# Altium schematic sheet Embedded_Chip.SchDoc
size A; SheetNumber: 4; SheetTotal: 9
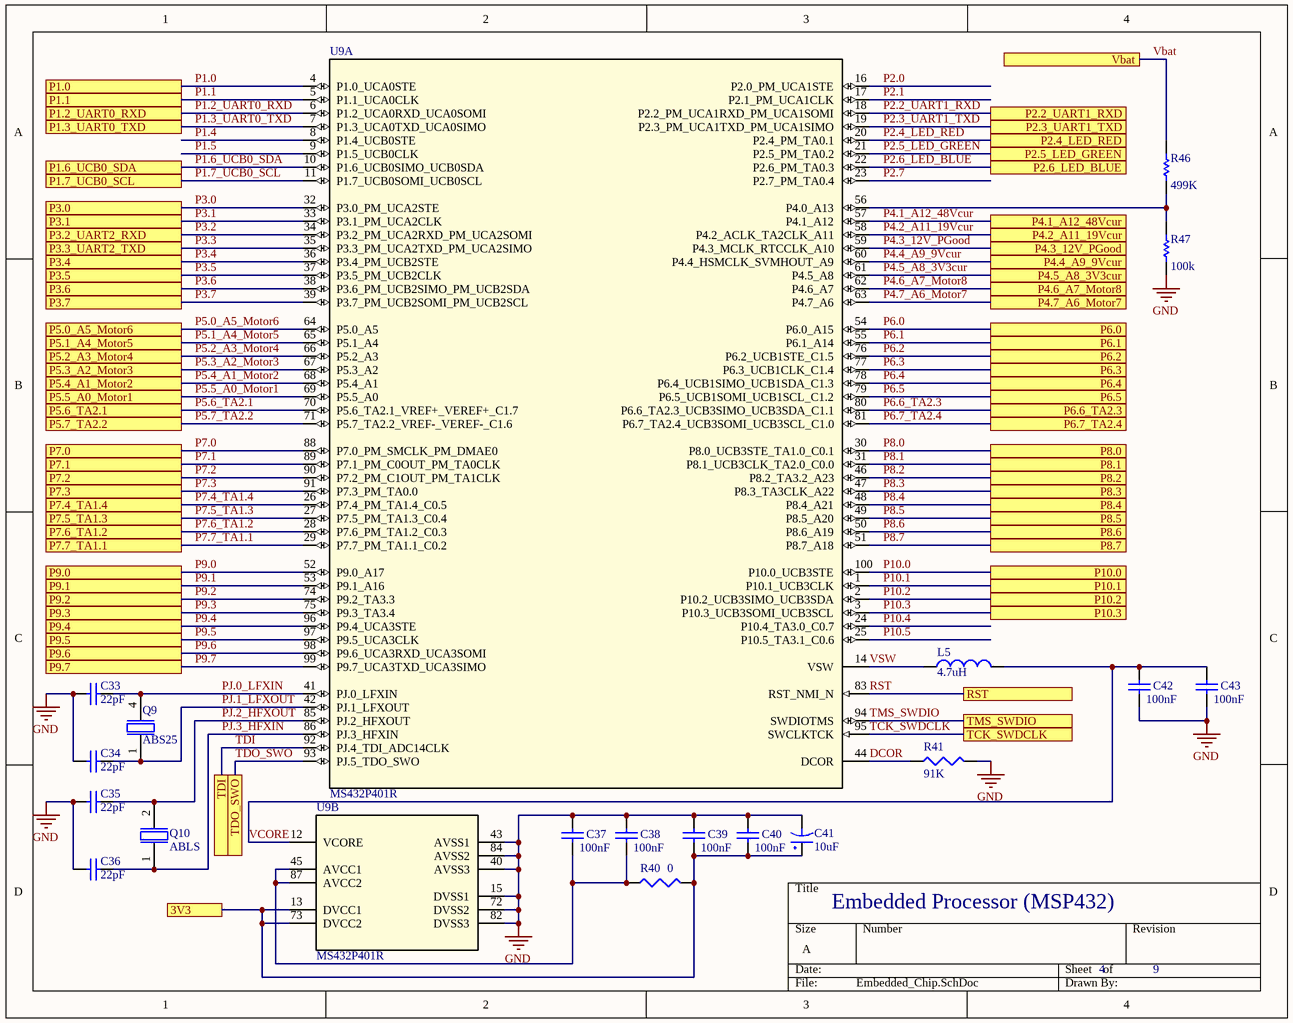
[diagram p0: Embedded_Chip.SchDoc]

## Parts
C33  value 22pF  [C1206]  (hidden comment: Cap Semi)
C34  value 22pF  [C1206]  (hidden comment: Cap Semi)
C35  value 22pF  [C1206]  (hidden comment: Cap Semi)
C36  value 22pF  [C1206]  (hidden comment: Cap Semi)
C37  value 100nF  [C1206]  (hidden comment: Cap Semi)
C38  value 100nF  [C1206]  (hidden comment: Cap Semi)
C39  value 100nF  [C1206]  (hidden comment: Cap Semi)
C40  value 100nF  [C1206]  (hidden comment: Cap Semi)
C41  10uF  [UWX1C100MCL2GB]
C42  value 100nF  [C1206]  (hidden comment: Cap Semi)
C43  value 100nF  [C1206]  (hidden comment: Cap Semi)
L5  value 4.7uH  [0806 (Metric 2016)]  (hidden comment: Inductor)
Q9  ABS25  [ABS25]
Q10  ABLS  [ABLS]
R40  value 0  [J1-0603]  (hidden comment: Res3)
R41  value 91K  [J1-0603]  (hidden comment: Res3)
R46  value 499K  [J1-0603]  (hidden comment: Res1)
R47  value 100k  [J1-0603]  (hidden comment: Res1)
U9  MS432P401R  [PZ0100A_M]  (parts A,B of 2)

## Ports
3V3, P1.0, P1.1, P1.2_UART0_RXD, P1.3_UART0_TXD, P1.6_UCB0_SDA, P1.7_UCB0_SCL, P2.2_UART1_RXD, P2.3_UART1_TXD, P2.4_LED_RED, P2.5_LED_GREEN, P2.6_LED_BLUE, P3.0, P3.1, P3.2_UART2_RXD, P3.3_UART2_TXD, P3.4, P3.5, P3.6, P3.7, P4.1_A12_48Vcur, P4.2_A11_19Vcur, P4.3_12V_PGood, P4.4_A9_9Vcur, P4.5_A8_3V3cur, P4.6_A7_Motor8, P4.7_A6_Motor7, P5.0_A5_Motor6, P5.1_A4_Motor5, P5.2_A3_Motor4, P5.3_A2_Motor3, P5.4_A1_Motor2, P5.5_A0_Motor1, P5.6_TA2.1, P5.7_TA2.2, P6.0, P6.1, P6.2, P6.3, P6.4, P6.5, P6.6_TA2.3, P6.7_TA2.4, P7.0, P7.1, P7.2, P7.3, P7.4_TA1.4, P7.5_TA1.3, P7.6_TA1.2, P7.7_TA1.1, P8.0, P8.1, P8.2, P8.3, P8.4, P8.5, P8.6, P8.7, P9.0, P9.1, P9.2, P9.3, P9.4, P9.5, P9.6, P9.7, P10.0, P10.1, P10.2, P10.3, RST, TCK_SWDCLK, TDI, TDO_SWO, TMS_SWDIO, Vbat

## Nets
GND: C33.1 C34.1 C35.1 C36.1 C37.2 C38.2 C39.2 C40.2 C41.2 C42.1 C43.1 R41.2 R47.1 U9.15(DVSS1) U9.40(AVSS3) U9.43(AVSS1) U9.72(DVSS2) U9.82(DVSS3) U9.84(AVSS2)
3V3: C39.1 C40.1 C41.1 R40.2 U9.13(DVCC1) U9.73(DVCC2) ; port 3V3
DCOR: R41.1 U9.44(DCOR)
P1.0: U9.4(P1.0_UCA0STE) ; port P1.0
P1.1: U9.5(P1.1_UCA0CLK) ; port P1.1
P1.2_UART0_RXD: U9.6(P1.2_UCA0RXD_UCA0SOMI) ; port P1.2_UART0_RXD
P1.3_UART0_TXD: U9.7(P1.3_UCA0TXD_UCA0SIMO) ; port P1.3_UART0_TXD
P1.4: U9.8(P1.4_UCB0STE)
P1.5: U9.9(P1.5_UCB0CLK)
P1.6_UCB0_SDA: U9.10(P1.6_UCB0SIMO_UCB0SDA) ; port P1.6_UCB0_SDA
P1.7_UCB0_SCL: U9.11(P1.7_UCB0SOMI_UCB0SCL) ; port P1.7_UCB0_SCL
P2.0: U9.16(P2.0_PM_UCA1STE)
P2.1: U9.17(P2.1_PM_UCA1CLK)
P2.2_UART1_RXD: U9.18(P2.2_PM_UCA1RXD_PM_UCA1SOMI) ; port P2.2_UART1_RXD
P2.3_UART1_TXD: U9.19(P2.3_PM_UCA1TXD_PM_UCA1SIMO) ; port P2.3_UART1_TXD
P2.4_LED_RED: U9.20(P2.4_PM_TA0.1) ; port P2.4_LED_RED
P2.5_LED_GREEN: U9.21(P2.5_PM_TA0.2) ; port P2.5_LED_GREEN
P2.6_LED_BLUE: U9.22(P2.6_PM_TA0.3) ; port P2.6_LED_BLUE
P2.7: U9.23(P2.7_PM_TA0.4)
P3.0: U9.32(P3.0_PM_UCA2STE) ; port P3.0
P3.1: U9.33(P3.1_PM_UCA2CLK) ; port P3.1
P3.2: U9.34(P3.2_PM_UCA2RXD_PM_UCA2SOMI) ; port P3.2_UART2_RXD
P3.3: U9.35(P3.3_PM_UCA2TXD_PM_UCA2SIMO) ; port P3.3_UART2_TXD
P3.4: U9.36(P3.4_PM_UCB2STE) ; port P3.4
P3.5: U9.37(P3.5_PM_UCB2CLK) ; port P3.5
P3.6: U9.38(P3.6_PM_UCB2SIMO_PM_UCB2SDA) ; port P3.6
P3.7: U9.39(P3.7_PM_UCB2SOMI_PM_UCB2SCL) ; port P3.7
P4.1_A12_48Vcur: U9.57(P4.1_A12) ; port P4.1_A12_48Vcur
P4.2_A11_19Vcur: U9.58(P4.2_ACLK_TA2CLK_A11) ; port P4.2_A11_19Vcur
P4.3_12V_PGood: U9.59(P4.3_MCLK_RTCCLK_A10) ; port P4.3_12V_PGood
P4.4_A9_9Vcur: U9.60(P4.4_HSMCLK_SVMHOUT_A9) ; port P4.4_A9_9Vcur
P4.5_A8_3V3cur: U9.61(P4.5_A8) ; port P4.5_A8_3V3cur
P4.6_A7_Motor8: U9.62(P4.6_A7) ; port P4.6_A7_Motor8
P4.7_A6_Motor7: U9.63(P4.7_A6) ; port P4.7_A6_Motor7
P5.0_A5_Motor6: U9.64(P5.0_A5) ; port P5.0_A5_Motor6
P5.1_A4_Motor5: U9.65(P5.1_A4) ; port P5.1_A4_Motor5
P5.2_A3_Motor4: U9.66(P5.2_A3) ; port P5.2_A3_Motor4
P5.3_A2_Motor3: U9.67(P5.3_A2) ; port P5.3_A2_Motor3
P5.4_A1_Motor2: U9.68(P5.4_A1) ; port P5.4_A1_Motor2
P5.5_A0_Motor1: U9.69(P5.5_A0) ; port P5.5_A0_Motor1
P5.6_TA2.1: U9.70(P5.6_TA2.1_VREF+_VEREF+_C1.7) ; port P5.6_TA2.1
P5.7_TA2.2: U9.71(P5.7_TA2.2_VREF-_VEREF-_C1.6) ; port P5.7_TA2.2
P6.0: U9.54(P6.0_A15) ; port P6.0
P6.1: U9.55(P6.1_A14) ; port P6.1
P6.2: U9.76(P6.2_UCB1STE_C1.5) ; port P6.2
P6.3: U9.77(P6.3_UCB1CLK_C1.4) ; port P6.3
P6.4: U9.78(P6.4_UCB1SIMO_UCB1SDA_C1.3) ; port P6.4
P6.5: U9.79(P6.5_UCB1SOMI_UCB1SCL_C1.2) ; port P6.5
P6.6_TA2.3: U9.80(P6.6_TA2.3_UCB3SIMO_UCB3SDA_C1.1) ; port P6.6_TA2.3
P6.7_TA2.4: U9.81(P6.7_TA2.4_UCB3SOMI_UCB3SCL_C1.0) ; port P6.7_TA2.4
P7.0: U9.88(P7.0_PM_SMCLK_PM_DMAE0) ; port P7.0
P7.1: U9.89(P7.1_PM_C0OUT_PM_TA0CLK) ; port P7.1
P7.2: U9.90(P7.2_PM_C1OUT_PM_TA1CLK) ; port P7.2
P7.3: U9.91(P7.3_PM_TA0.0) ; port P7.3
P7.4_TA1.4: U9.26(P7.4_PM_TA1.4_C0.5) ; port P7.4_TA1.4
P7.5_TA1.3: U9.27(P7.5_PM_TA1.3_C0.4) ; port P7.5_TA1.3
P7.6_TA1.2: U9.28(P7.6_PM_TA1.2_C0.3) ; port P7.6_TA1.2
P7.7_TA1.1: U9.29(P7.7_PM_TA1.1_C0.2) ; port P7.7_TA1.1
P8.0: U9.30(P8.0_UCB3STE_TA1.0_C0.1) ; port P8.0
P8.1: U9.31(P8.1_UCB3CLK_TA2.0_C0.0) ; port P8.1
P8.2: U9.46(P8.2_TA3.2_A23) ; port P8.2
P8.3: U9.47(P8.3_TA3CLK_A22) ; port P8.3
P8.4: U9.48(P8.4_A21) ; port P8.4
P8.5: U9.49(P8.5_A20) ; port P8.5
P8.6: U9.50(P8.6_A19) ; port P8.6
P8.7: U9.51(P8.7_A18) ; port P8.7
P9.0: U9.52(P9.0_A17) ; port P9.0
P9.1: U9.53(P9.1_A16) ; port P9.1
P9.2: U9.74(P9.2_TA3.3) ; port P9.2
P9.3: U9.75(P9.3_TA3.4) ; port P9.3
P9.4: U9.96(P9.4_UCA3STE) ; port P9.4
P9.5: U9.97(P9.5_UCA3CLK) ; port P9.5
P9.6: U9.98(P9.6_UCA3RXD_UCA3SOMI) ; port P9.6
P9.7: U9.99(P9.7_UCA3TXD_UCA3SIMO) ; port P9.7
P10.0: U9.100(P10.0_UCB3STE) ; port P10.0
P10.1: U9.1(P10.1_UCB3CLK) ; port P10.1
P10.2: U9.2(P10.2_UCB3SIMO_UCB3SDA) ; port P10.2
P10.3: U9.3(P10.3_UCB3SOMI_UCB3SCL) ; port P10.3
P10.4: U9.24(P10.4_TA3.0_C0.7)
P10.5: U9.25(P10.5_TA3.1_C0.6)
PJ.0_LFXIN: C33.2 Q9.4 U9.41(PJ.0_LFXIN)
PJ.1_LFXOUT: C34.2 Q9.1 U9.42(PJ.1_LFXOUT)
PJ.2_HFXOUT: C35.2 Q10.2 U9.85(PJ.2_HFXOUT)
PJ.3_HFXIN: C36.2 Q10.1 U9.86(PJ.3_HFXIN)
RST: U9.83(RST_NMI_N) ; port RST
TCK_SWDCLK: U9.95(SWCLKTCK) ; port TCK_SWDCLK
TDI: U9.92(PJ.4_TDI_ADC14CLK) ; port TDI
TDO_SWO: U9.93(PJ.5_TDO_SWO) ; port TDO_SWO
TMS_SWDIO: U9.94(SWDIOTMS) ; port TMS_SWDIO
Vbat: R46.2 ; port Vbat
VCORE: C42.2 C43.2 L5.2 U9.12(VCORE)
VSW: L5.1 U9.14(VSW)
NetC37_1: C37.1 C38.1 R40.1 U9.45(AVCC1) U9.87(AVCC2)
NetR46_1: R46.1 R47.2 U9.56(P4.0_A13)

## Notes on the sheet
- Embedded Processor (MSP432)

## Library data of the parts
C33-C40 C42 C43 = Cap Semi: Capacitor (Semiconductor SIM Model); Published: 8-Jun-2000; LatestRevisionDate: 29-May-2009; LatestRevisionNote: IPC-7351 Footprint Added.; PackageReference: C1206; Publisher: Altium Limited; PackageDescription: Chip Capacitor
C41 = UWX1C100MCL2GB: CAP ALUM 10UF 20% 16V SMD; Digikey: https://www.digikey.com/product-detail/en/nichicon/UWX1C100MCL2GB/493-2099-1-ND/590074; Datasheet: http://nichicon-us.com/english/products/pdfs/e-uwx.pdf
L5 = Inductor: Code_IEC: 1005; Published: 8-Jun-2000; LatestRevisionDate: 29-May-2009; LatestRevisionNote: IPC-7351 Footprint Added.; PackageReference: 0402-A; Publisher: Altium Limited; PackageDescription: Chip Inductor; Code_JEITA: 0402; Supplier 1: Digi-Key; Supplier Part Number 1: 732-2956-1-ND
Q9 = ABS25: 32.768 kHz Low Frequency SMD Crystal; Datasheet: https://abracon.com/Resonators/abs25.pdf
Q10 = ABLS: SMD Low Profile Crystal - 3.579545 MHz to 75 MHz; Datasheet: https://abracon.com/Resonators/abls.pdf
R40 R41 = Res3: Resistor; Published: 8-Jun-2000; LatestRevisionDate: 29-May-2009; LatestRevisionNote: IPC-7351 Footprint Added.; PackageReference: J1-0603; Publisher: Altium Limited; PackageDescription: Chip Resistor
R46 R47 = Res1: Resistor; Published: 8-Jun-2000; LatestRevisionDate: 17-Jul-2002; LatestRevisionNote: Re-released for DXP Platform.; PackageReference: AXIAL-0.3; Publisher: Altium Limited; PackageDescription: Axial Device, Thru-Hole; 2 Leads; 0.3 in Pin Spacing
U9 = MS432P401R-IPZR: SimpleLink Ultra-Low-Power 32-Bit ARM Cortex-M4F MCU With Precision ADC, 256KB Flash and 64KB RAM; PartNumber: XMS432P401RIPZR; Manufacturer: Texas Instruments; CompType: IC; PIN_COUNT: 100; PackageReference: PZ0100A; MountType: SMT; RefDes: RefDes; TYPE: TYPE; Value: Value